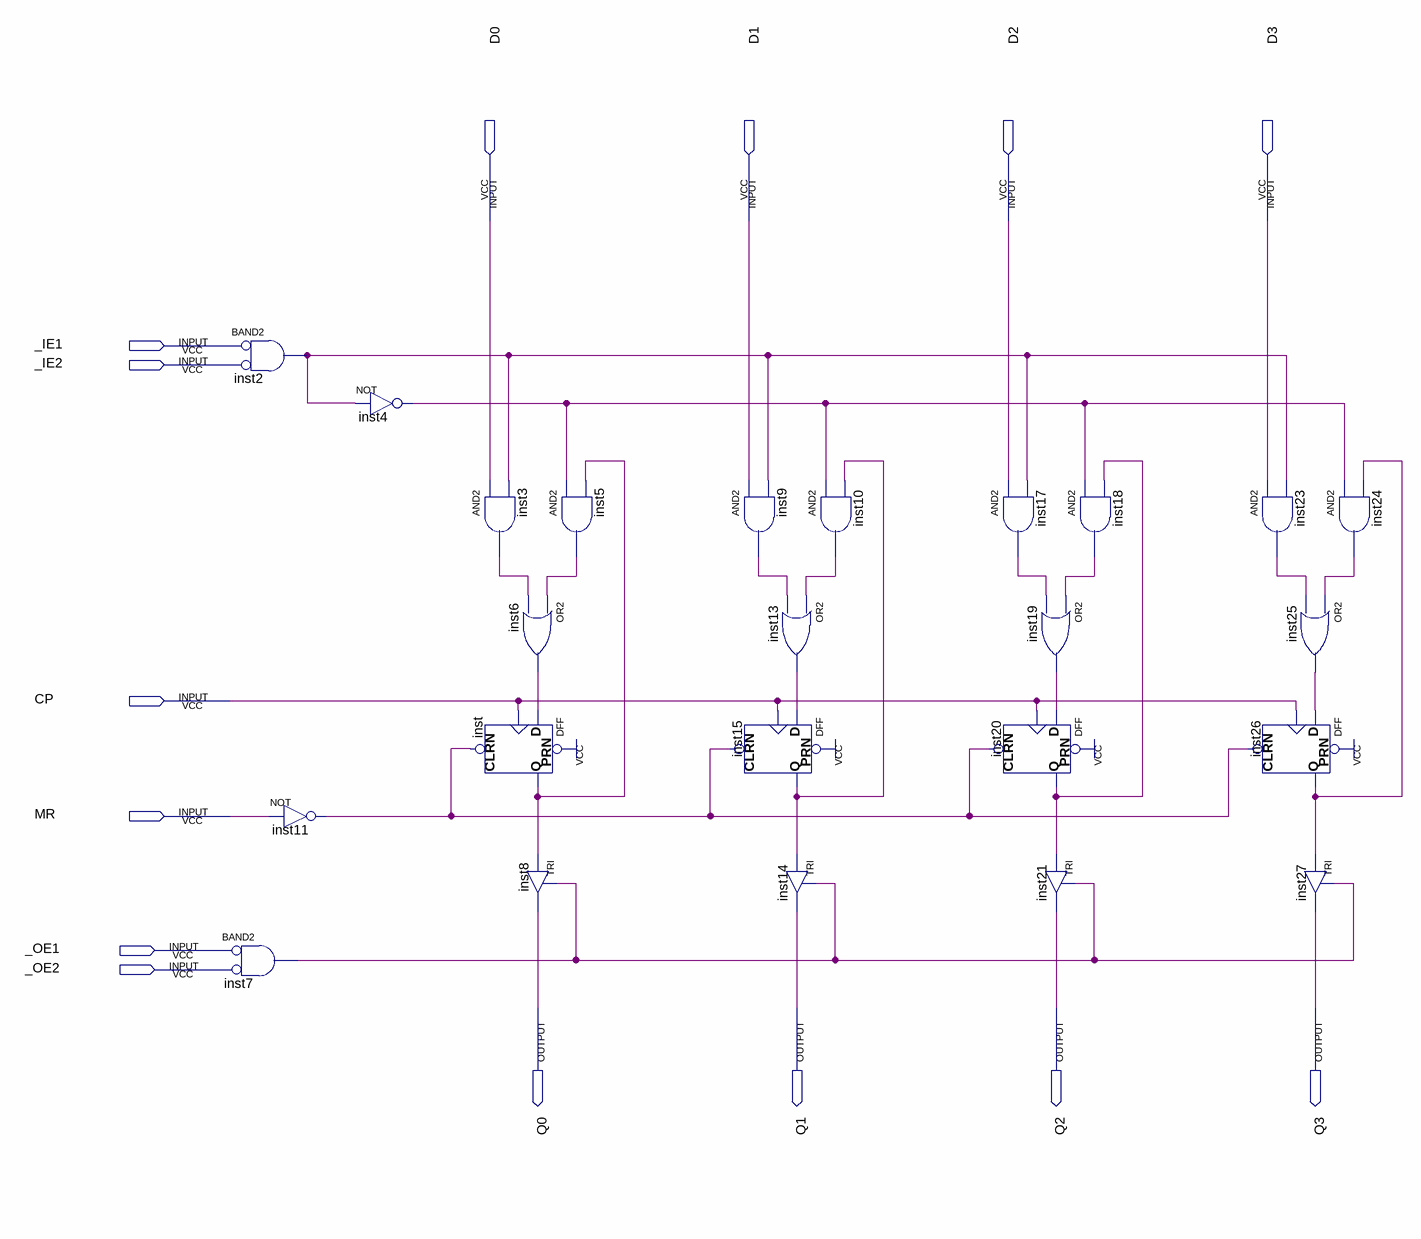
[diagram p0: schematic sheet]
// Quartus schematic SN74LS173.bdf as structural Verilog: 24 symbols, 14 pins
module SN74LS173 (
  input  D0,
  input  D1,
  input  D2,
  input  D3,
  input  _IE1,
  input  _IE2,
  input  CP,
  input  MR,
  input  _OE1,
  input  _OE2,
  output Q0,
  output Q1,
  output Q2,
  output Q3
);

  wire inst2_out, inst3_out, inst4_out, inst5_out, inst6_out, inst7_out, inst9_out, inst10_out, inst11_out,
       inst13_out, inst15_q, inst17_out, inst18_out, inst19_out, inst20_q, inst23_out, inst24_out,
       inst25_out, inst26_q, inst_q;

  and inst2 (inst2_out, ~_IE1, ~_IE2);  // BAND2
  and inst7 (inst7_out, ~_OE1, ~_OE2);  // BAND2
  not inst11 (inst11_out, MR);
  not inst4 (inst4_out, inst2_out);
  and inst3 (inst3_out, D0, inst2_out);
  or inst6 (inst6_out, inst5_out, inst3_out);
  DFF inst (.CLRN(inst11_out), .CLK(CP), .D(inst6_out), .PRN(1'b1), .Q(inst_q));
  TRI inst8 (.IN(inst_q), .OE(inst7_out), .OUT(Q0));
  and inst5 (inst5_out, inst4_out, inst_q);
  and inst9 (inst9_out, D1, inst2_out);
  or inst13 (inst13_out, inst10_out, inst9_out);
  DFF inst15 (.CLRN(inst11_out), .CLK(CP), .D(inst13_out), .PRN(1'b1), .Q(inst15_q));
  and inst10 (inst10_out, inst4_out, inst15_q);
  TRI inst14 (.IN(inst15_q), .OE(inst7_out), .OUT(Q1));
  and inst17 (inst17_out, D2, inst2_out);
  DFF inst20 (.CLRN(inst11_out), .CLK(CP), .D(inst19_out), .PRN(1'b1), .Q(inst20_q));
  and inst18 (inst18_out, inst4_out, inst20_q);
  or inst19 (inst19_out, inst18_out, inst17_out);
  TRI inst21 (.IN(inst20_q), .OE(inst7_out), .OUT(Q2));
  and inst23 (inst23_out, D3, inst2_out);
  or inst25 (inst25_out, inst24_out, inst23_out);
  DFF inst26 (.CLRN(inst11_out), .CLK(CP), .D(inst25_out), .PRN(1'b1), .Q(inst26_q));
  TRI inst27 (.IN(inst26_q), .OE(inst7_out), .OUT(Q3));
  and inst24 (inst24_out, inst4_out, inst26_q);
endmodule
